# Altium schematic sheet STM32控制器.schdoc
size A1
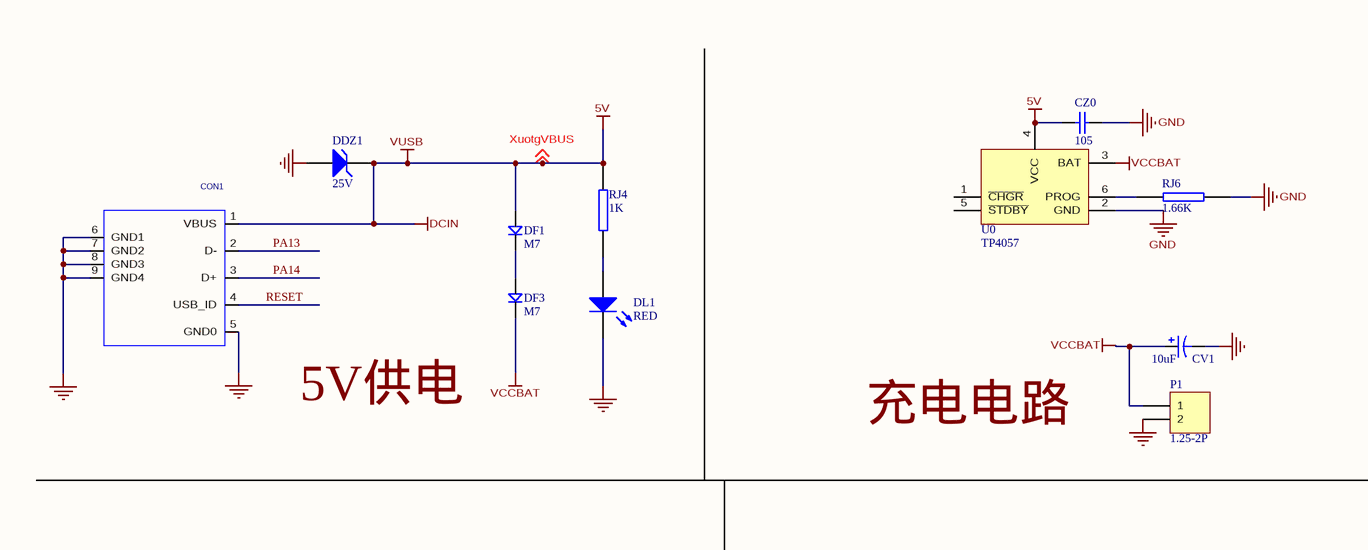
[diagram p0: STM32控制器.schdoc, top left]
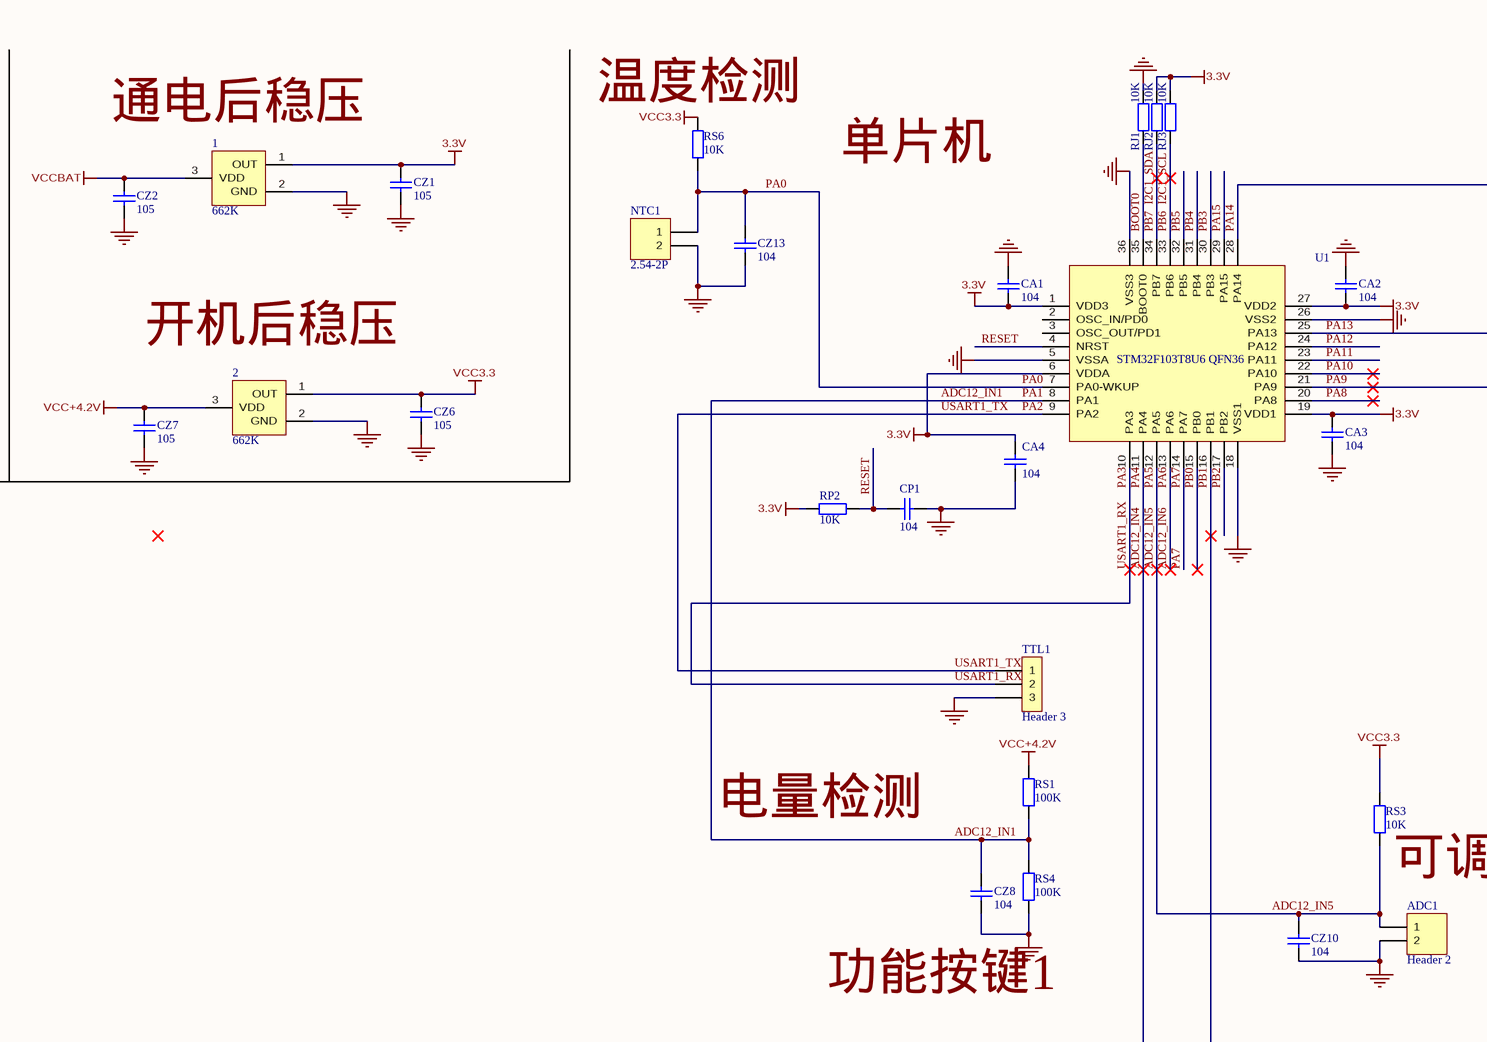
[diagram p1: STM32控制器.schdoc, top middle]
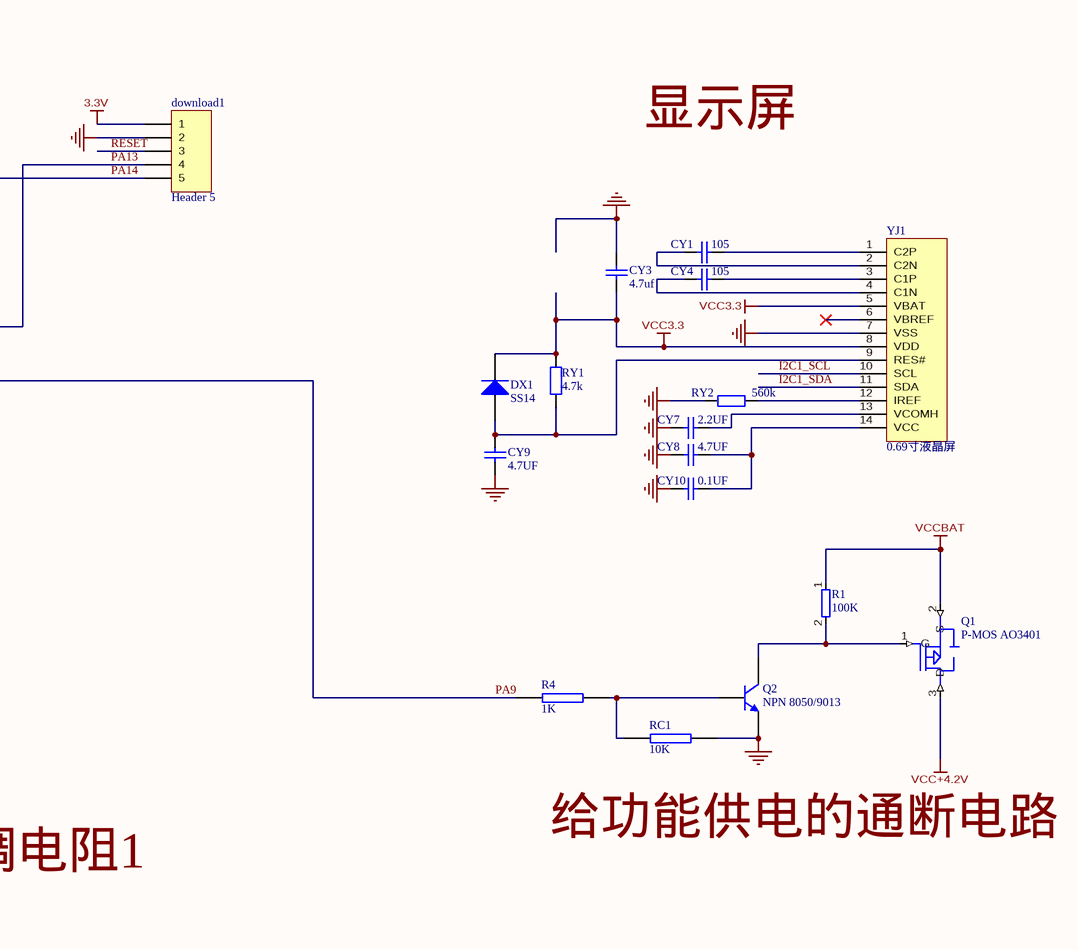
[diagram p2: STM32控制器.schdoc, top right]
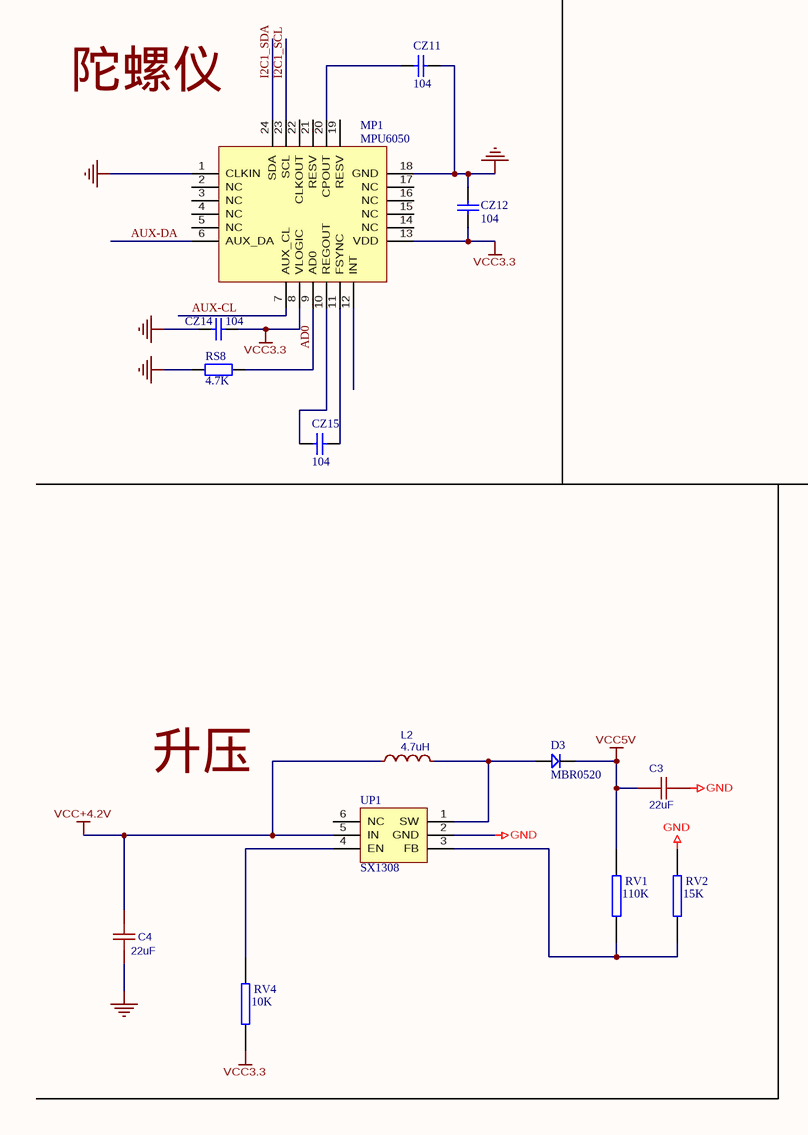
[diagram p3: STM32控制器.schdoc, bottom left]
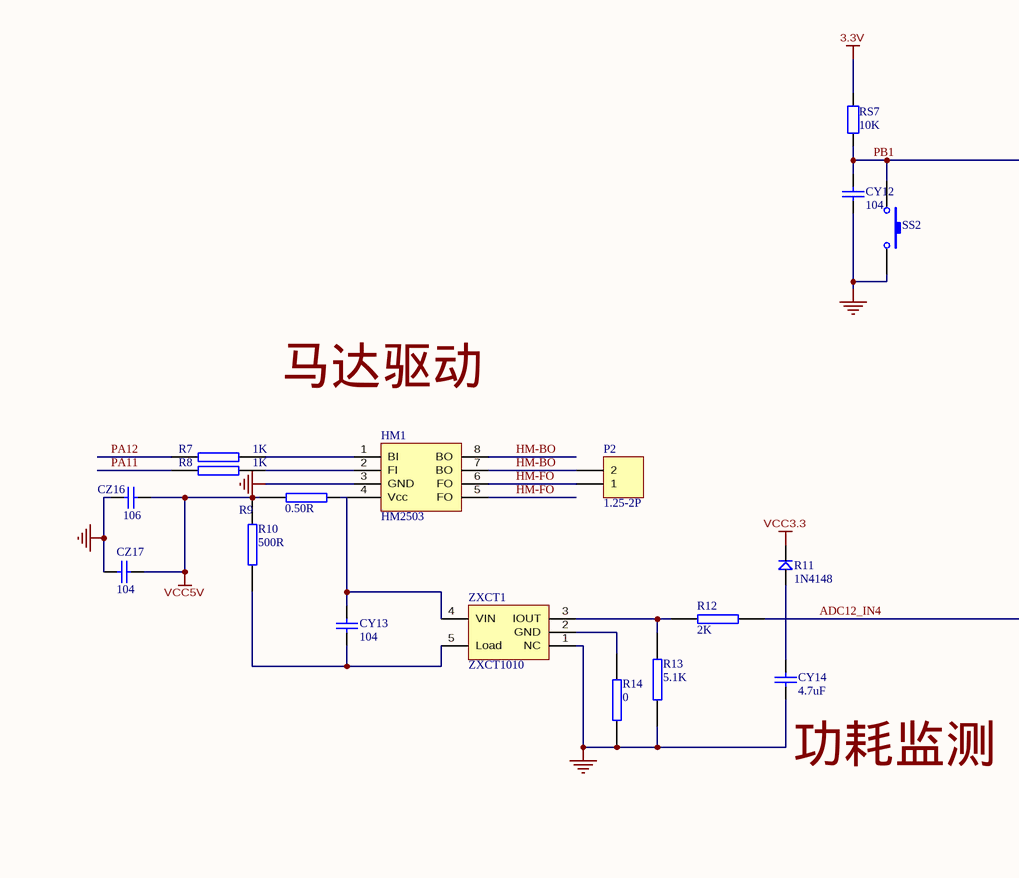
[diagram p4: STM32控制器.schdoc, bottom middle]

## Parts
1  662K  [SOT23-3-1]
2  662K  [SOT23-3-1]
ADC1  Header 2  [HDR1X2]
C3  22uF  [0805]
C4  22uF  [0805]
CA1  104  [0402]
CA2  104  [0402]
CA3  104  [0402]
CA4  104  [0402]
CON1  USB_1  [USB 贴片 - 2]  (value not drawn)
CP1  104  [0402]
CV1  10uF  [0402]
CY1  105  [0402]
CY3  4.7uf  [0402]
CY4  105  [0402]
CY7  2.2UF  [0402]
CY8  4.7UF  [0402]
CY9  4.7UF  [0402]
CY10  0.1UF  [0402]
CY12  104  [0402]
CY13  104  [0402]
CY14  4.7uF  [0402]
CZ0  105  [0402]
CZ1  105  [0402]
CZ2  105  [0402]
CZ6  105  [0402]
CZ7  105  [0402]
CZ8  104  [0402]
CZ10  104  [0402]
CZ11  104  [0402]
CZ12  104  [0402]
CZ13  104  [0402]
CZ14  104  [0402]
CZ15  104  [0402]
CZ16  106  [0402]
CZ17  104  [0402]
D3  MBR0520  [SOD-123]
DDZ1  25V  [DIODE_SOP]
DF1  M7  [DIODE_SOP]
DF3  M7  [DIODE_SOP]
DL1  RED  [0603]
download1  Header 5  [HDR1X5]
DX1  SS14  [0603]
HM1  HM2503  [SOP-8]
L2  4.7uH  [L3*3mm]
MP1  MPU6050  [QFN24]
NTC1  2.54-2P  [HDR1X2]
P1  1.25-2P  [1.25卧贴-立式通用-2P]
P2  1.25-2P  [1.25卧贴-立式通用-2P]
Q1  P-MOS AO3401  [SOT23]
Q2  NPN 8050/9013  [NPN-SOT3]
R1  100K  [0402]
R4  1K  [0402]
R7  1K  [0402]
R8  1K  [0402]
R9  0.50R  [0805]
R10  500R  [0402]
R11  1N4148  [DIODE_SOP]
R12  2K  [0402]
R13  5.1K  [0402]
R14  0  [0402]
RC1  10K  [0402]
RJ1  10K  [0402]
RJ2  10K  [0402]
RJ3  10K  [0402]
RJ4  1K  [0402]
RJ6  1.66K  [0402]
RP2  10K  [0402]
RS1  100K  [0402]
RS3  10K  [0402]
RS4  100K  [0402]
RS6  10K  [0402]
RS7  10K  [0402]
RS8  4.7K  [0402]
RV1  110K  [0402]
RV2  15K  [0402]
RV4  10K  [0402]
RY1  4.7k  [0402]
RY2  560k  [0402]
SS2  SW-PB  [SW_smt3*3]  (value not drawn)
TTL1  Header 3  [HDR1X3]
U0  TP4057  [SOT23-6]
U1  STM32F103T8U6 QFN36
UP1  SX1308  [SOT23-6]
YJ1  0.69寸液晶屏  [0.86寸 oled 显示屏]
ZXCT1  ZXCT1010  [SOT23-5]

## Nets
3.3V: 1.1(OUT) CA1.1 CA2.1 CA3.1 CA4.1 CZ1.1 download1.1 RJ2.2 RJ3.2 RP2.1 RS7.1 U1.1(VDD3) U1.6(VDDA) U1.19(VDD1) U1.27(VDD2)
5V: CON1.1(VBUS) CZ0.2 DDZ1.2(K) DF1.1 RJ4.1 U0.4(VCC) ; off-sheet XuotgVBUS  [also labelled DCIN, VUSB, XuotgVBUS]
GND: 1.2(GND) 2.2(GND) ADC1.2 C3.1 C4.1 CA1.2 CA2.2 CA3.2 CA4.2 CON1.5(GND0) CON1.6(GND1) CON1.7(GND2) CON1.8(GND3) CON1.9(GND4) CP1.2 CV1.2 CY3.2 CY7.2 CY8.2 CY9.1 CY10.2 CY12.2 CY14.2 CZ0.1 CZ1.2 CZ2.2 CZ6.2 CZ7.2 CZ8.1 CZ10.1 CZ11.1 CZ12.2 CZ13.1 CZ14.2 CZ16.1 CZ17.1 DDZ1.1(A) DL1.2(K) download1.2 HM1.3(GND) MP1.1(CLKIN) MP1.18(GND) NTC1.2 P1.2 Q2.3(E) R13.1 R14.1 RC1.1 RJ1.2 RJ6.2 RS4.2 RS8.1 RV2.2 RY2.1 SS2.2 TTL1.3 U0.2(GND) U1.5(VSSA) U1.18(VSS1) U1.26(VSS2) U1.36(VSS3) UP1.2(GND) YJ1.7(VSS) ZXCT1.1(NC)
VCC3.3: 2.1(OUT) CY3.1 CZ6.1 CZ12.1 CZ14.1 DX1.2(K) MP1.8(VLOGIC) MP1.13(VDD) R11.2 RS3.1 RS6.1 RV4.1 RY1.2 YJ1.5(VBAT) YJ1.8(VDD)
VCC5V: C3.2 CZ16.2 CZ17.2 D3.2 R9.1 R10.2 RV1.2
VCC+4.2V: 2.3(VDD) C4.2 CZ7.1 L2.1 Q1.3(D) RS1.1 UP1.5(IN)
VCCBAT: 1.3(VDD) CV1.1 CZ2.1 DF3.2 P1.1 Q1.2(S) R1.1 U0.3(BAT)
AD0: MP1.9(AD0) RS8.2
ADC12_IN1: CZ8.2 RS1.2 RS4.1 U1.8(PA1)  [also labelled PA1]
ADC12_IN4: R12.1 U1.11(PA4)  [also labelled PA4]
ADC12_IN5: ADC1.1 CZ10.2 RS3.2 U1.12(PA5)  [also labelled PA5]
ADC12_IN6: U1.13(PA6)  [also labelled PA6]
AUX-CL: MP1.7(AUX_CL)
AUX-DA: MP1.6(AUX_DA)
BOOT0: RJ1.1 U1.35(BOOT0)
HM-BO: HM1.7(BO) HM1.8(BO) P2.2
HM-FO: HM1.5(FO) HM1.6(FO) P2.1
I2C1_SCL: MP1.23(SCL) RJ3.1 U1.33(PB6) YJ1.10(SCL)  [also labelled PB6]
I2C1_SDA: MP1.24(SDA) RJ2.1 U1.34(PB7) YJ1.11(SDA)  [also labelled PB7]
PA0: CZ13.2 NTC1.1 RS6.2 U1.7(PA0-WKUP)
PA2: TTL1.1 U1.9(PA2)  [also labelled USART1_TX]
PA3: TTL1.2 U1.10(PA3)  [also labelled USART1_RX]
PA7: U1.14(PA7)
PA8: U1.20(PA8)
PA9: R4.2 U1.21(PA9)
PA10: U1.22(PA10)
PA11: R8.2 U1.23(PA11)
PA12: R7.2 U1.24(PA12)
PA13: CON1.2(D-) download1.4 U1.25(PA13)
PA14: CON1.3(D+) download1.5 U1.28(PA14)
PA15: U1.29(PA15)
PB0: U1.15(PB0)
PB1: CY12.1 RS7.2 SS2.1 U1.16(PB1)
PB2: U1.17(PB2)
PB3: U1.30(PB3)
PB4: U1.31(PB4)
PB5: U1.32(PB5)
RESET: CON1.4(USB_ID) CP1.1 download1.3 RP2.2 U1.4(NRST)
NetCY1_1: CY1.1 YJ1.1(C2P)
NetCY1_2: CY1.2 YJ1.2(C2N)
NetCY4_1: CY4.1 YJ1.3(C1P)
NetCY4_2: CY4.2 YJ1.4(C1N)
NetCY7_1: CY7.1 YJ1.13(VCOMH)
NetCY8_1: CY8.1 CY10.1 YJ1.14(VCC)
NetCY9_2: CY9.2 DX1.1(A) RY1.1 YJ1.9(RES#)
NetCY13_1: CY13.1 ZXCT1.4(VIN)
NetCY13_2: CY13.2 R10.1 ZXCT1.5(Load)
NetCY14_1: CY14.1 R11.1
NetCZ11_2: CZ11.2 MP1.20(CPOUT)
NetCZ15_1: CZ15.1 MP1.11(FSYNC)
NetCZ15_2: CZ15.2 MP1.10(REGOUT)
NetD3_1: D3.1 L2.2 UP1.1(SW)
NetDF1_2: DF1.2 DF3.1
NetDL1_1: DL1.1(A) RJ4.2
NetHM1_1: HM1.1(BI) R7.1
NetHM1_2: HM1.2(FI) R8.1
NetHM1_4: HM1.4(Vcc) R9.2
NetQ1_1: Q1.1(G) Q2.1(C) R1.2
NetQ2_2: Q2.2(B) R4.1 RC1.2
NetR12_2: R12.2 R13.2 ZXCT1.3(IOUT)
NetR14_2: R14.2 ZXCT1.2(GND)
NetRJ6_1: RJ6.1 U0.6(PROG)
NetRV1_1: RV1.1 RV2.1 UP1.3(FB)
NetRV4_2: RV4.2 UP1.4(EN)
NetRY2_2: RY2.2 YJ1.12(IREF)

Not connected (* = marked no-connect by the designer): MP1 2(NC) 3(NC) 4(NC) 5(NC) 12(INT) 14(NC) 15(NC) 16(NC) 17(NC) 19(RESV) 21(RESV) 22(CLKOUT); U0 1(~{CHGR}) 5(~{STDBY}); U1 2(OSC_IN/PD0) 3(OSC_OUT/PD1); UP1 6(NC); YJ1 6(VBREF)*

## Notes on the sheet
- Labels drawn without touching a wire or pin: 5V供电, 充电电路, 功耗监测, 功能按键1, 升压, 单片机, 可调电阻1, 开机后稳压, 显示屏, 温度检测, 电量检测, 给功能供电的通断电路, 通电后稳压, 陀螺仪, 马达驱动

## Library data of the parts
1 2 = MH5330
ADC1 NTC1 P1 P2 = Header 2: Header, 2-Pin; LatestRevisionDate: 17-Jul-2002; LatestRevisionNote: Re-released for DXP Platform.; Publisher: Altium Limited
C3 C4 = 47uF: BOM_Manufacturer: SAMSUNG; BOM_Manufacturer Part: CL05A105KA5NQNC; Value: 47UF; Voltage: 25V; Tolerance: ±10%; BOM_Supplier Part: C52923; BOM_Supplier: LCSC; BOM_LCSC Assembly: Yes; spicePre: C
CA1-CA4 CP1 CY12 CY13 CZ1 CZ2 CZ6-CZ8 CZ10-CZ17 = 104: Capacitor
  CA1-CA4 CP1 CY12 CY13 CZ10: Published: 8-Jun-2000; LatestRevisionDate: 17-Jul-2002; LatestRevisionNote: Re-released for DXP Platform.; PackageReference: RAD-0.3; Publisher: Altium Limited; Value: 104
CV1 = Cap Pol1: Polarized Capacitor (Radial)
CY1 CY4 CY14 CZ0 = 104: Capacitor; Value: 104; Published: 8-Jun-2000; LatestRevisionDate: 17-Jul-2002; LatestRevisionNote: Re-released for DXP Platform.; PackageReference: RAD-0.3; Publisher: Altium Limited
CY3 CY7-CY10 = Cap: Capacitor; Value: 0.01uF; Published: 8-Jun-2000; LatestRevisionDate: 17-Jul-2002; LatestRevisionNote: Re-released for DXP Platform.; PackageReference: RAD-0.3; Publisher: Altium Limited
D3 = D_1: 1N4148
DDZ1 = D Zener: Zener Diode
DF1 DF3 R11 = D
DL1 = LED1: Typical RED GaAs LED; Published: 8-Jun-2000; LatestRevisionDate: 08-Jul-2005; LatestRevisionNote: Mech Layer 1 removed.; PackageReference: LED-1; Publisher: Altium Limited
download1 = Header 5: Header, 5-Pin; LatestRevisionDate: 17-Jul-2002; LatestRevisionNote: Re-released for DXP Platform.; Publisher: Altium Limited
DX1 = Diode 1N4001: 1 Amp General Purpose Rectifier; Published: 8-Jun-2000; LatestRevisionDate: 17-Jul-2002; LatestRevisionNote: Re-released for DXP Platform.; DatasheetDocument: 1998; PackageDocument: Aug-1999; PackageReference: DO-41; Publisher: Altium Limited; Code_JEDEC: DO-204-AL; ComponentLink1Description: Manufacturer Link; ComponentLink1URL: http://www.fairchildsemi.com/; ComponentLink2Description: Datasheet; ComponentLink2URL: http://www.fairchildsemi.com/ds/1N%2F1N4001.pdf
L2 = 2.2uH
Q1 = AO3401
Q2 = NPN: NPN Bipolar Transistor
R1 = RES
R4 R7-R10 R12-R14 RC1 RJ4 RJ6 RV1 RV2 RV4 = RES2
RJ1-RJ3 RS1 RS4 RS6 RS8 = Res2: Resistor
RP2 RS3 RS7 RY1 RY2 = Res2: Resistor; Value: 1K; Published: 8-Jun-2000; LatestRevisionDate: 17-Jul-2002; LatestRevisionNote: Re-released for DXP Platform.; PackageReference: AXIAL-0.4; Publisher: Altium Limited
SS2 = SW-PB: Switch; Published: 24-Mar-1999; LatestRevisionDate: 17-Jul-2002; LatestRevisionNote: Re-released for DXP Platform.; PackageReference: SPST-2; Publisher: Altium Limited
TTL1 = Header 3: Header, 3-Pin; LatestRevisionDate: 17-Jul-2002; LatestRevisionNote: Re-released for DXP Platform.; Publisher: Altium Limited
YJ1 = 0.86寸液晶屏